# Altium schematic sheet microcontroller.SchDoc
size A4; SheetNumber: 3; SheetTotal: 5
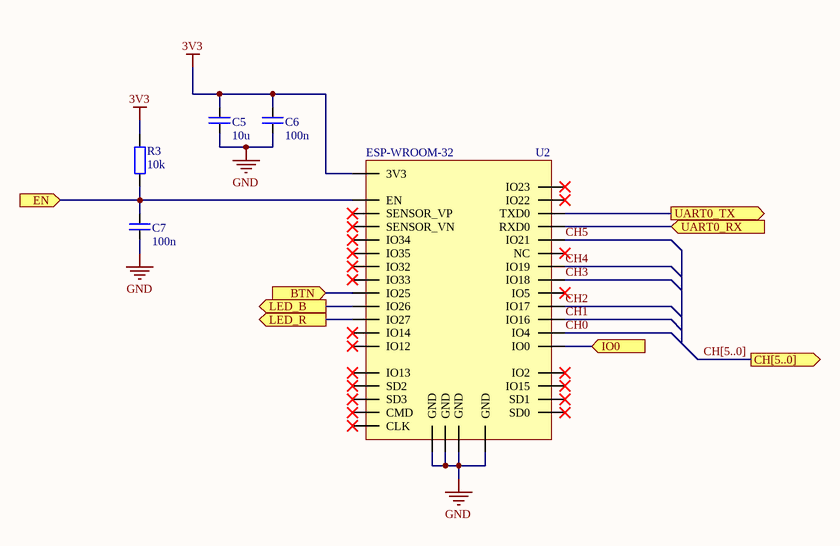
[diagram p0: microcontroller.SchDoc]

## Parts
C5  10u  [capacitor_smd_0805]
C6  100n  [capacitor_smd_0603]
C7  100n  [capacitor_smd_0603]
R3  10k  [resisitor_smd_0603]
U2  ESP-WROOM-32  [ESP-WROOM-32_no_silk]

## Ports
BTN (in, see LEDcontroller[3C], user_interfaces[4C]), CH[5..0] (out, see LEDcontroller[3B], channels_driver[1A]), EN (in, see LEDcontroller[3C], user_interfaces[1A]), IO0 (in, see LEDcontroller[3C], user_interfaces[1A]), LED_B (out, see LEDcontroller[3C], user_interfaces[2C]), LED_R (out, see LEDcontroller[3C], user_interfaces[2C]), UART0_RX (in, see LEDcontroller[3B], user_interfaces[1A]), UART0_TX (out, see LEDcontroller[3B], user_interfaces[1A])

## Nets
3V3: C5.1 C6.1 R3.1 U2.2(3V3)
GND: C5.2 C6.2 C7.2 U2.1(GND) U2.15(GND) U2.38(GND) U2.39(GND)
BTN: U2.10(IO25) ; port BTN
CH0: U2.26(IO4)
CH1: U2.27(IO16)
CH2: U2.28(IO17)
CH3: U2.30(IO18)
CH4: U2.31(IO19)
CH5: U2.33(IO21)
EN: C7.1 R3.2 U2.3(EN) ; port EN
IO0: U2.25(IO0) ; port IO0
LED_B: U2.11(IO26) ; port LED_B
LED_R: U2.12(IO27) ; port LED_R
UART0_RX: U2.34(RXD0) ; port UART0_RX
UART0_TX: U2.35(TXD0) ; port UART0_TX

Not connected (* = marked no-connect by the designer): U2 4(SENSOR_VP)* 5(SENSOR_VN)* 6(IO34)* 7(IO35)* 8(IO32)* 9(IO33)* 13(IO14)* 14(IO12)* 16(IO13)* 17(SD2)* 18(SD3)* 19(CMD)* 20(CLK)* 21(SD0)* 22(SD1)* 23(IO15)* 24(IO2)* 29(IO5)* 32(NC)* 36(IO22)* 37(IO23)*

## Buses and harness runs
bus CH[5..0] = port CH[5..0]

## Library data of the parts
C5 = Capacitor - non-polarised: TAIYO YUDEN TMK212BBJ106MGHT
C6 C7 = Capacitor - non-polarised: Vishay GA0603Y104KXAAC31G
R3 = Resistor: Vishay CRCW060310K0FKEI
U2 = ESP-WROOM-32: Espressif ESP-WROOM-32